# Altium schematic sheet touchpad.SchDoc
size A4
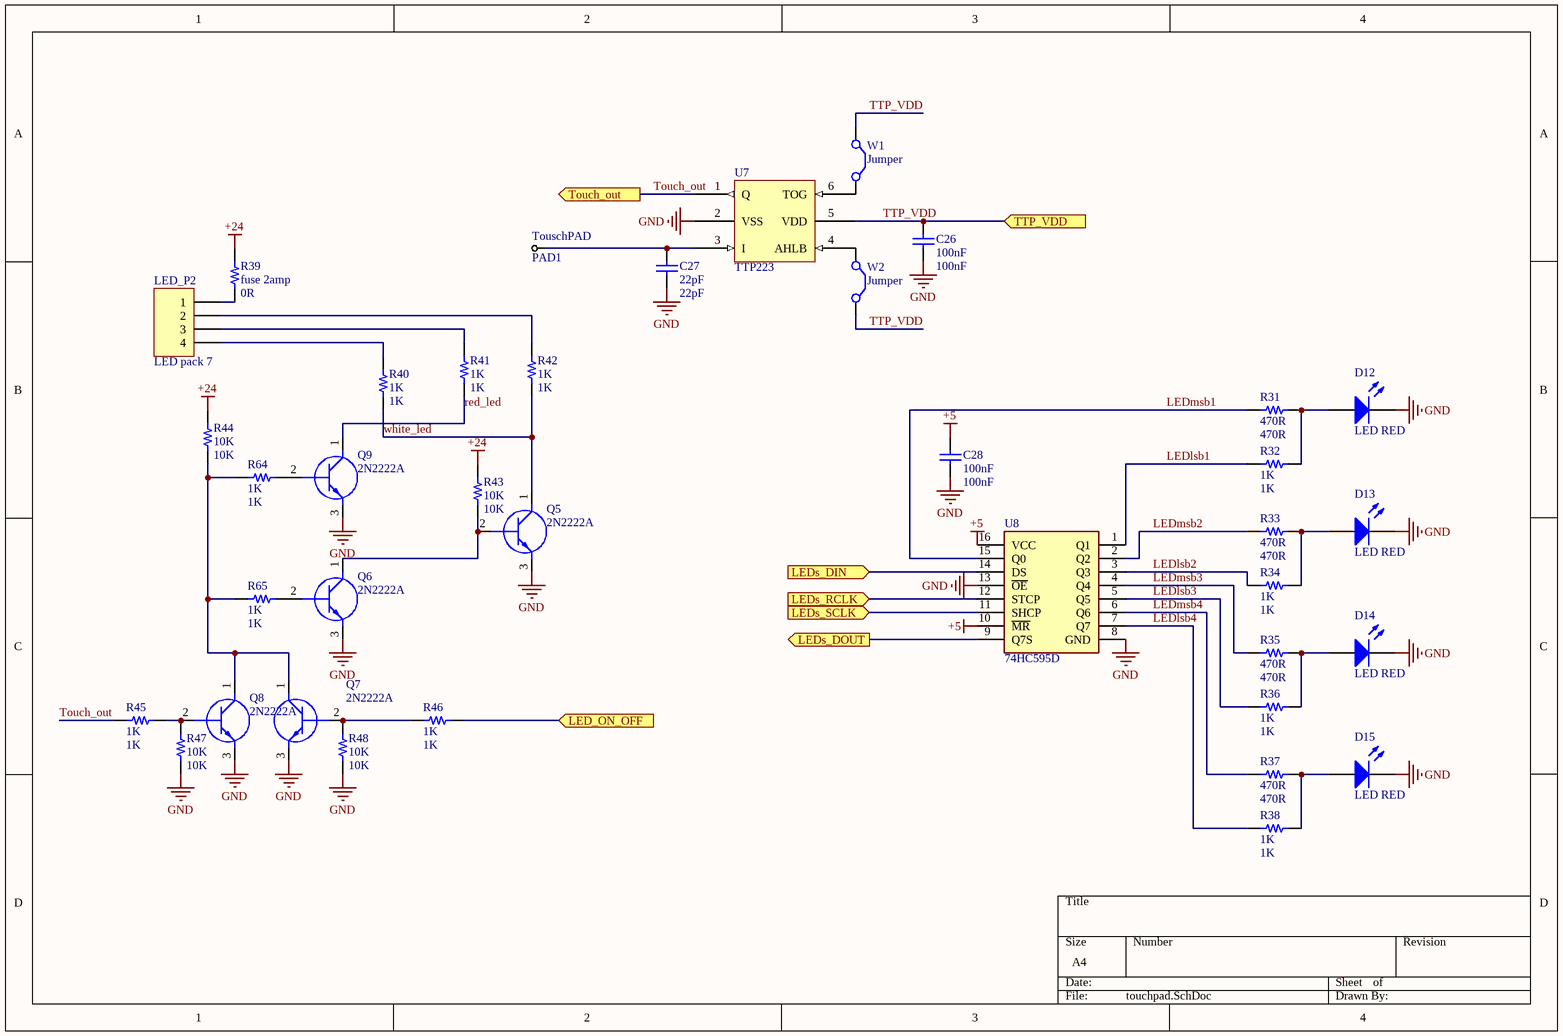
[diagram p0: touchpad.SchDoc]

## Parts
C26  100nF  [0603C]
C27  22pF  [0603C]
C28  100nF  [0603C]
D12  LED RED  [LED_0805 G]
D13  LED RED  [LED_0805 G]
D14  LED RED  [LED_0805 G]
D15  LED RED  [LED_0805 G]
LED_P2  LED pack 7  [LED_PAKC_7]
PAD1  TouschPAD  [touchPAD]  (no BOM)
Q5  2N2222A  [soT95p280x130-3n]
Q6  2N2222A  [soT95p280x130-3n]
Q7  2N2222A  [soT95p280x130-3n]
Q8  2N2222A  [soT95p280x130-3n]
Q9  2N2222A  [soT95p280x130-3n]
R31  470R  [0603R]
R32  1K  [0603R]
R33  470R  [0603R]
R34  1K  [0603R]
R35  470R  [0603R]
R36  1K  [0603R]
R37  470R  [0603R]
R38  1K  [0603R]
R39  fuse 2amp  value 0R  [1206 FUSE]
R40  1K  [RES1812]
R41  1K  [RES1812]
R42  1K  [RES1812]
R43  10K  [0603R]
R44  10K  [0603R]
R45  1K  [0603R]
R46  1K  [0603R]
R47  10K  [0603R]
R48  10K  [0603R]
R64  1K  [0603R]
R65  1K  [0603R]
U7  TTP223  [SOT23-6_L]
U8  74HC595D  [SOIC127P600X175-16N]
W1  Jumper  [JUMPER]  (no BOM)
W2  Jumper  [JUMPER]  (no BOM)

## Ports
LED_ON_OFF (in), LEDs_DIN (in), LEDs_DOUT (out), LEDs_RCLK (in), LEDs_SCLK (in), Touch_out (out), TTP_VDD (in)

## Nets
+5: C28.2 U8.10(~{MR}) U8.16(VCC)
+24: R39.1 R43.1 R44.1
GND: C26.1 C27.1 C28.1 D12.2(K) D13.2(K) D14.2(K) D15.2(K) Q5.3(E) Q6.3(E) Q7.3(E) Q8.3(E) Q9.3(E) R47.2 R48.2 U7.2(VSS) U8.8(GND) U8.13(~{OE})
LED_ON_OFF: R46.2 ; port LED_ON_OFF
LEDlsb1: R32.2 U8.1(Q1)
LEDlsb2: R34.2 U8.3(Q3)
LEDlsb3: R36.2 U8.5(Q5)
LEDlsb4: R38.2 U8.7(Q7)
LEDmsb1: R31.2 U8.15(Q0)
LEDmsb2: R33.2 U8.2(Q2)
LEDmsb3: R35.2 U8.4(Q4)
LEDmsb4: R37.2 U8.6(Q6)
LEDs_DIN: U8.14(DS) ; port LEDs_DIN
LEDs_DOUT: U8.9(Q7S) ; port LEDs_DOUT
LEDs_RCLK: U8.12(STCP) ; port LEDs_RCLK
LEDs_SCLK: U8.11(SHCP) ; port LEDs_SCLK
red_led: Q9.1(C) R41.2
Touch_out: R45.1 U7.1(Q) ; port Touch_out
TTP_VDD: C26.2 U7.5(VDD) W1.1(C1) W2.2(C2) ; port TTP_VDD
white_led: Q5.1(C) R40.2 R42.2
NetC27_2: C27.2 PAD1.1(T) U7.3(I)
NetD12_1: D12.1(A) R31.1 R32.1
NetD13_1: D13.1(A) R33.1 R34.1
NetD14_1: D14.1(A) R35.1 R36.1
NetD15_1: D15.1(A) R37.1 R38.1
NetLED_P2_1: LED_P2.1 R39.2
NetLED_P2_2: LED_P2.2 R42.1
NetLED_P2_3: LED_P2.3 R41.1
NetLED_P2_4: LED_P2.4 R40.1
NetQ5_2: Q5.2(B) Q6.1(C) R43.2
NetQ6_2: Q6.2(B) R65.2
NetQ7_1: Q7.1(C) Q8.1(C) R44.2 R64.1 R65.1
NetQ7_2: Q7.2(B) R46.1 R48.1
NetQ8_2: Q8.2(B) R45.2 R47.1
NetQ9_2: Q9.2(B) R64.2
NetU7_4: U7.4(AHLB) W2.1(C1)
NetU7_6: U7.6(TOG) W1.2(C2)

## Library data of the parts
C26 C28 = Cap: CAP SMD 0603; Published: 8-Jun-2000; LatestRevisionDate: 17-Jul-2002; LatestRevisionNote: Re-released for DXP Platform.; PackageReference: RAD-0.3; Publisher: Altium Limited; PackageDescription: Radial Cap, Thru-Hole; 2 Leads; 0.3 in Pin Spacing; Value: 100nF
C27 = Cap: X7R_NPO; Published: 8-Jun-2000; LatestRevisionDate: 17-Jul-2002; LatestRevisionNote: Re-released for DXP Platform.; PackageReference: RAD-0.3; Publisher: Altium Limited; PackageDescription: Radial Cap, Thru-Hole; 2 Leads; 0.3 in Pin Spacing; Value: 22pF
D12-D15 = LED0: LED SMD 0805 RED; Published: 8-Jun-2000; LatestRevisionDate: 08-Jul-2005; LatestRevisionNote: Mech Layer 1 removed.; PackageReference: LED-0; Publisher: Altium Limited; PackageDescription: LED; 2 Leads
LED_P2 = Header 4: 7led-red white LED pack; LatestRevisionDate: 17-Jul-2002; LatestRevisionNote: Re-released for DXP Platform.; Publisher: Altium Limited
PAD1 = Test Point
Q5-Q9 = 2N2222A: Transistor BJT NPN SMD; pin to pad: 1>3 2>1 3>2; Manufacturer_Name: Foshan Blue Rocket Elec; Datasheet Link: https://datasheet.lcsc.com/szlcsc/1901291437_Foshan-Blue-Rocket-Elec-2N2222A_C358533.pdf; Height: 4.7mm; Manufacturer_Part_Number: 2N2222A
R31-R38 R43-R48 R64 R65 = Resistor: RES SMD 0603; Part Number: RCS0805100KFKEA
  R31 R33 R35 R37: Value: 470R
  R32 R34 R36 R38 R45 R46 R64 R65: Value: 1K
  R43 R44 R47 R48: Value: 10K
R39 = Resistor: Fuse 1206; Part Number: RCS0805100KFKEA
R40-R42 = Resistor: RES SMD 1812; Part Number: RCS0805100KFKEA; Value: 1K
U7 = ttp223b: capacitive touch IC
U8 = 74HC595D: 74HC595 SMD; Manufacturer_Name: Nexperia; Datasheet Link: https://componentsearchengine.com/Datasheets/2/74HC595D.pdf; Height: 1.75mm; Manufacturer_Part_Number: 74HC595D; Mouser Part Number: N/A; Mouser Price/Stock: https://www.mouser.com/Search/Refine.aspx?Keyword=N%2FA
W1 W2 = Jumper: Jumper Wire; Published: 24-Mar-1999; LatestRevisionDate: 17-Jul-2002; LatestRevisionNote: Re-released for DXP Platform.; PackageReference: RAD-0.2; Publisher: Altium Limited; PackageDescription: Radial Cap, Thru-Hole; 2 Leads; 0.2 in Pin Spacing